# Altium schematic sheet General.SchDoc
size A4; Date: *******; ApprovedBy: *******; CheckedBy: Dora; Author: *******; CompanyName: *******; DrawnBy: Loreto y Marcos; Engineer: *******; Organization: *******; Address1: *******; Address2: *******; Address3: *******; Address4: *******; DocumentNumber: 1; Revision: *******; SheetNumber: 1; SheetTotal: 4; CurrentTime: *******; CurrentDate: *******; Time: *******; DocumentFullPathAndName: *******; DocumentName: *******; ModifiedDate: *******; ImagePath: *******; ProjectName: *******; Application_BuildNumber: *******
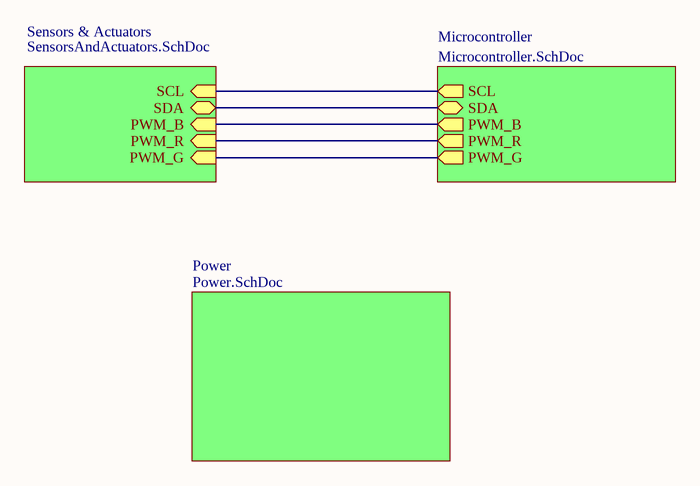
[diagram p0: General.SchDoc]

## Sub-sheets
Microcontroller = Microcontroller.SchDoc: PWM_B (out), PWM_G (out), SDA (bidir), SCL (out), PWM_R (out)
Power = Power.SchDoc: no entries
Sensors & Actuators = SensorsAndActuators.SchDoc: SDA (bidir), PWM_B (in), SCL (in), PWM_R (in), PWM_G (in)

## Nets
(unnamed): sheet Microcontroller/PWM_B, sheet Sensors & Actuators/PWM_B
(unnamed): sheet Microcontroller/PWM_G, sheet Sensors & Actuators/PWM_G
(unnamed): sheet Microcontroller/SDA, sheet Sensors & Actuators/SDA
(unnamed): sheet Microcontroller/SCL, sheet Sensors & Actuators/SCL
(unnamed): sheet Microcontroller/PWM_R, sheet Sensors & Actuators/PWM_R

## Notes on the sheet
- Title:
- Drawn By:
- Page Contents:
- Checked By:
- Size:
- Date:
- File:
- License:
- Email:
- A4
- Number:
- Time:
- Revision:
- Sheet
- Website:
- of